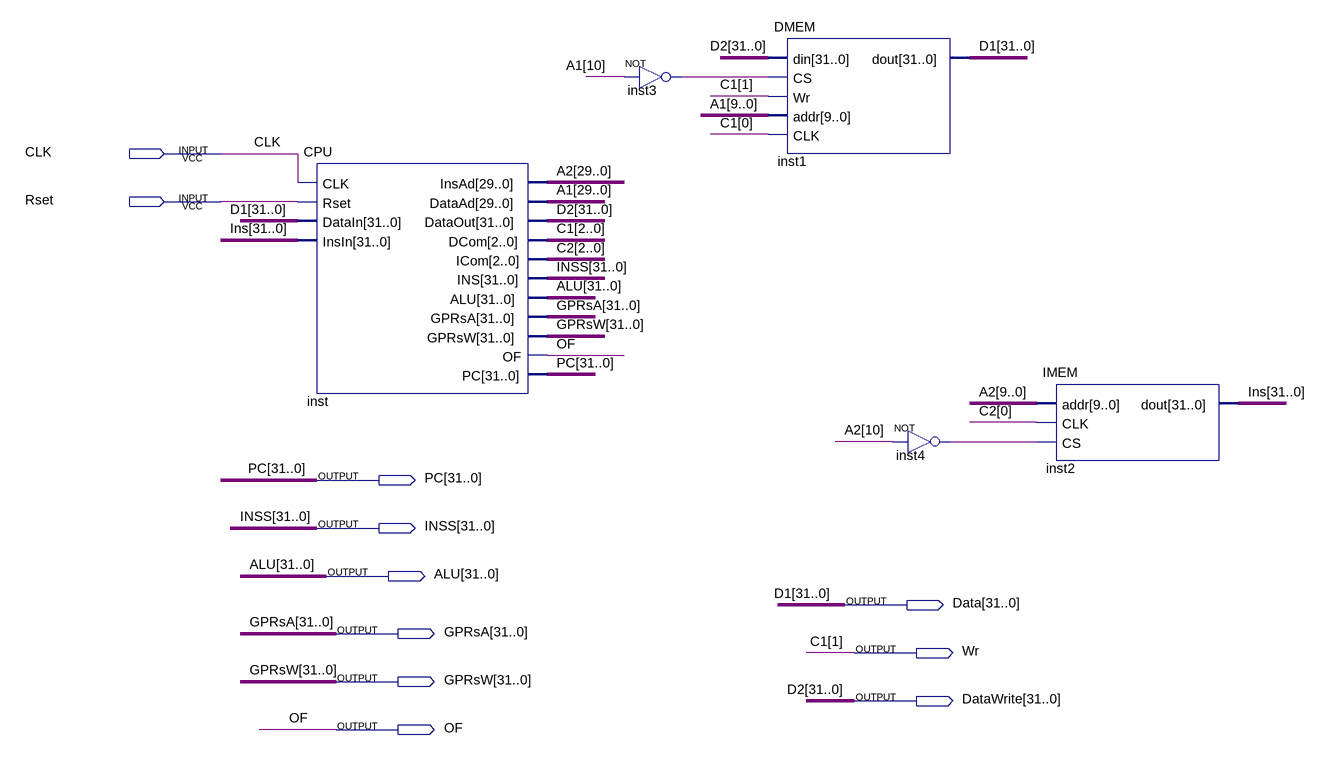
[diagram p0: schematic sheet]
// Quartus schematic COMPUTER.bdf as structural Verilog: 5 symbols, 11 pins
module COMPUTER (
  input  CLK,
  input  Rset,
  output [31:0] PC,
  output [31:0] INSS,
  output [31:0] ALU,
  output [31:0] Data,
  output [31:0] GPRsA,
  output Wr,
  output [31:0] GPRsW,
  output [31:0] DataWrite,
  output OF
);

  wire inst3_out, inst4_out;
  wire [2:0] C1, C2;
  wire [29:0] A1, A2;
  wire [31:0] Ins;

  CPU inst (
    .CLK(CLK), .Rset(Rset), .DataIn(Data), .InsIn(Ins), .InsAd(A2), .DataAd(A1), .DataOut(DataWrite),
    .DCom({C1[2], Wr, C1[0]}), .ICom(C2), .INS(INSS), .ALU(ALU), .GPRsA(GPRsA), .GPRsW(GPRsW), .OF(OF),
    .PC(PC));
  not inst3 (inst3_out, A1[10]);
  DMEM inst1 (.din(DataWrite), .CS(inst3_out), .Wr(Wr), .addr(A1[9:0]), .CLK(C1[0]), .dout(Data));
  not inst4 (inst4_out, A2[10]);
  IMEM inst2 (.addr(A2[9:0]), .CLK(C2[0]), .CS(inst4_out), .dout(Ins));

  // Other names for the same wires on the sheet: C1[1] = Wr; D1[31:0] = Data; D2[31:0] = DataWrite
endmodule
